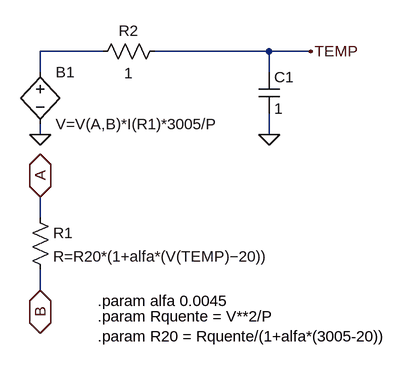
[diagram p0: schematic Lampada.asc]
Lampada.asc, the LTspice schematic file:
Version 4
SHEET 1 880 680
WIRE 240 -112 144 -112
WIRE 496 -112 320 -112
WIRE 560 -112 496 -112
WIRE 144 -80 144 -112
WIRE 496 -80 496 -112
WIRE 144 16 144 0
WIRE 496 16 496 -16
WIRE 144 144 144 112
WIRE 144 256 144 224
FLAG 144 112 A
IOPIN 144 112 BiDir
FLAG 144 256 B
IOPIN 144 256 BiDir
FLAG 144 16 0
FLAG 560 -112 TEMP
FLAG 496 16 0
SYMBOL res 128 128 R0
SYMATTR InstName R1
SYMATTR Value R=R20*(1+alfa*(V(TEMP)−20))
SYMBOL bv 144 -96 R0
SYMATTR InstName B1
SYMATTR Value V=V(A,B)*I(R1)*3005/P
SYMBOL res 224 -96 R270
WINDOW 0 32 56 VTop 2
WINDOW 3 -2 56 VBottom 2
SYMATTR InstName R2
SYMATTR Value 1
SYMBOL cap 480 -80 R0
SYMATTR InstName C1
SYMATTR Value 1
TEXT 232 272 Left 2 !.param alfa 0.0045
TEXT 232 296 Left 2 !.param Rquente = V**2/P\n.param R20 = Rquente/(1+alfa*(3005-20))

The netlist it stands for:
* Lampada.asc
R1 A B R=R20*(1+alfa*(V(TEMP)−20))
B1 N001 0 V=V(A,B)*I(R1)*3005/P
R2 N001 TEMP 1
C1 TEMP 0 1
.param alfa 0.0045
.param Rquente = V**2/P
.param R20 = Rquente/(1+alfa*(3005-20))
.backanno
.end